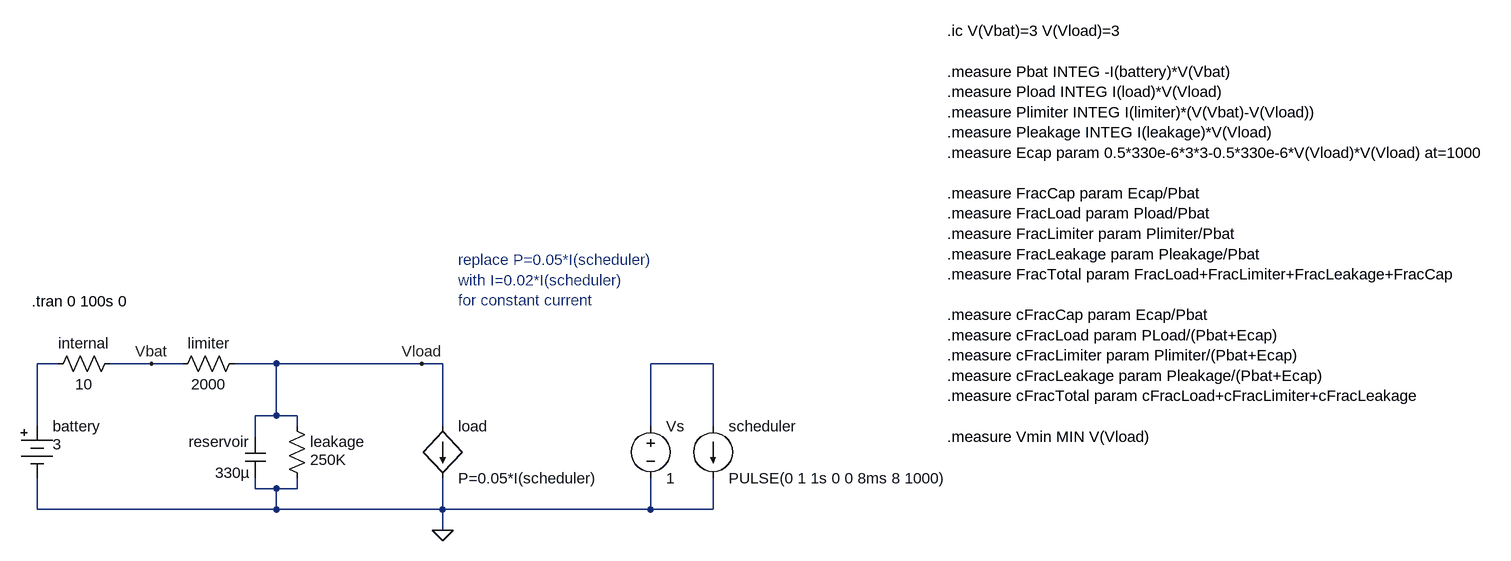
[diagram p0: schematic limiter-reservoir-cap.asc]
limiter-reservoir-cap.asc, the LTspice schematic file:
Version 4
SHEET 1 2332 680
WIRE 32 48 0 48
WIRE 176 48 112 48
WIRE 224 48 176 48
WIRE 368 48 304 48
WIRE 592 48 368 48
WIRE 624 48 592 48
WIRE 1040 48 944 48
WIRE 368 128 368 48
WIRE 368 128 336 128
WIRE 400 128 368 128
WIRE 0 144 0 48
WIRE 400 144 400 128
WIRE 624 144 624 48
WIRE 944 144 944 48
WIRE 1040 144 1040 48
WIRE 336 160 336 128
WIRE 336 240 336 224
WIRE 368 240 336 240
WIRE 400 240 400 224
WIRE 400 240 368 240
WIRE 0 272 0 224
WIRE 368 272 368 240
WIRE 368 272 0 272
WIRE 624 272 624 224
WIRE 624 272 368 272
WIRE 944 272 944 224
WIRE 944 272 624 272
WIRE 1040 272 1040 224
WIRE 1040 272 944 272
WIRE 624 304 624 272
FLAG 624 304 0
FLAG 176 48 Vbat
FLAG 592 48 Vload
SYMBOL Misc\\battery 0 128 R0
WINDOW 3 24 44 Left 2
WINDOW 123 0 0 Left 2
WINDOW 39 0 0 Left 2
SYMATTR Value 3
SYMATTR InstName battery
SYMBOL cap 352 160 M0
SYMATTR InstName reservoir
SYMATTR Value 330µ
SYMATTR SpiceLine Rser=0.05
SYMBOL res 384 128 R0
WINDOW 3 36 68 Left 2
SYMATTR Value 250K
SYMATTR InstName leakage
SYMBOL res 208 64 R270
WINDOW 0 32 56 VTop 2
WINDOW 3 0 56 VBottom 2
SYMATTR InstName limiter
SYMATTR Value 2000
SYMBOL res 16 64 R270
WINDOW 0 32 56 VTop 2
WINDOW 3 0 56 VBottom 2
SYMATTR InstName internal
SYMATTR Value 10
SYMBOL bi 624 144 R0
SYMATTR InstName load
SYMATTR Value P=0.05*I(scheduler)
SYMBOL voltage 944 128 R0
WINDOW 123 0 0 Left 0
WINDOW 39 0 0 Left 0
SYMATTR InstName Vs
SYMATTR Value 1
SYMBOL current 1040 144 R0
WINDOW 123 0 0 Left 2
WINDOW 39 0 0 Left 2
SYMATTR InstName scheduler
SYMATTR Value PULSE(0 1 1s 0 0 8ms 8 1000)
TEXT -8 -48 Left 2 !.tran 0 100s 0
TEXT 1400 -464 Left 2 !.ic V(Vbat)=3 V(Vload)=3\n \n.measure Pbat INTEG -I(battery)*V(Vbat)\n.measure Pload INTEG I(load)*V(Vload)\n.measure Plimiter INTEG I(limiter)*(V(Vbat)-V(Vload))\n.measure Pleakage INTEG I(leakage)*V(Vload)\n.measure Ecap param 0.5*330e-6*3*3-0.5*330e-6*V(Vload)*V(Vload) at=1000\n \n.measure FracCap param Ecap/Pbat\n.measure FracLoad param Pload/Pbat\n.measure FracLimiter param Plimiter/Pbat\n.measure FracLeakage param Pleakage/Pbat\n.measure FracTotal param FracLoad+FracLimiter+FracLeakage+FracCap\n \n.measure cFracCap param Ecap/Pbat\n.measure cFracLoad param PLoad/(Pbat+Ecap)\n.measure cFracLimiter param Plimiter/(Pbat+Ecap)\n.measure cFracLeakage param Pleakage/(Pbat+Ecap)\n.measure cFracTotal param cFracLoad+cFracLimiter+cFracLeakage\n \n.measure Vmin MIN V(Vload)
TEXT 648 -112 Left 2 ;replace P=0.05*I(scheduler)\nwith I=0.02*I(scheduler)\nfor constant current

The netlist it stands for:
* limiter-reservoir-cap.asc
V§battery N001 0 3
C§reservoir Vload 0 330µ Rser=0.05
R§leakage Vload 0 250K
R§limiter Vbat Vload 2000
R§internal N001 Vbat 10
B§load Vload 0 P=0.05*I(scheduler)
Vs N002 0 1
I§scheduler N002 0 PULSE(0 1 1s 0 0 8ms 8 1000)
.tran 0 100s 0
.ic V(Vbat)=3 V(Vload)=3
.measure Pbat INTEG -I(battery)*V(Vbat)
.measure Pload INTEG I(load)*V(Vload)
.measure Plimiter INTEG I(limiter)*(V(Vbat)-V(Vload))
.measure Pleakage INTEG I(leakage)*V(Vload)
.measure Ecap param 0.5*330e-6*3*3-0.5*330e-6*V(Vload)*V(Vload) at=1000
.measure FracCap param Ecap/Pbat
.measure FracLoad param Pload/Pbat
.measure FracLimiter param Plimiter/Pbat
.measure FracLeakage param Pleakage/Pbat
.measure FracTotal param FracLoad+FracLimiter+FracLeakage+FracCap
.measure cFracCap param Ecap/Pbat
.measure cFracLoad param PLoad/(Pbat+Ecap)
.measure cFracLimiter param Plimiter/(Pbat+Ecap)
.measure cFracLeakage param Pleakage/(Pbat+Ecap)
.measure cFracTotal param cFracLoad+cFracLimiter+cFracLeakage
.measure Vmin MIN V(Vload)
* replace P=0.05*I(scheduler)
* with I=0.02*I(scheduler)
* for constant current
.backanno
.end